# Altium schematic sheet nRF51822.SchDoc: nRF51822
size A4; Revision: Rev.A1; SheetNumber: 1; SheetTotal: 4; DrawnBy: RUBR; DocumentSize: A4; ProjectName: Wikiot
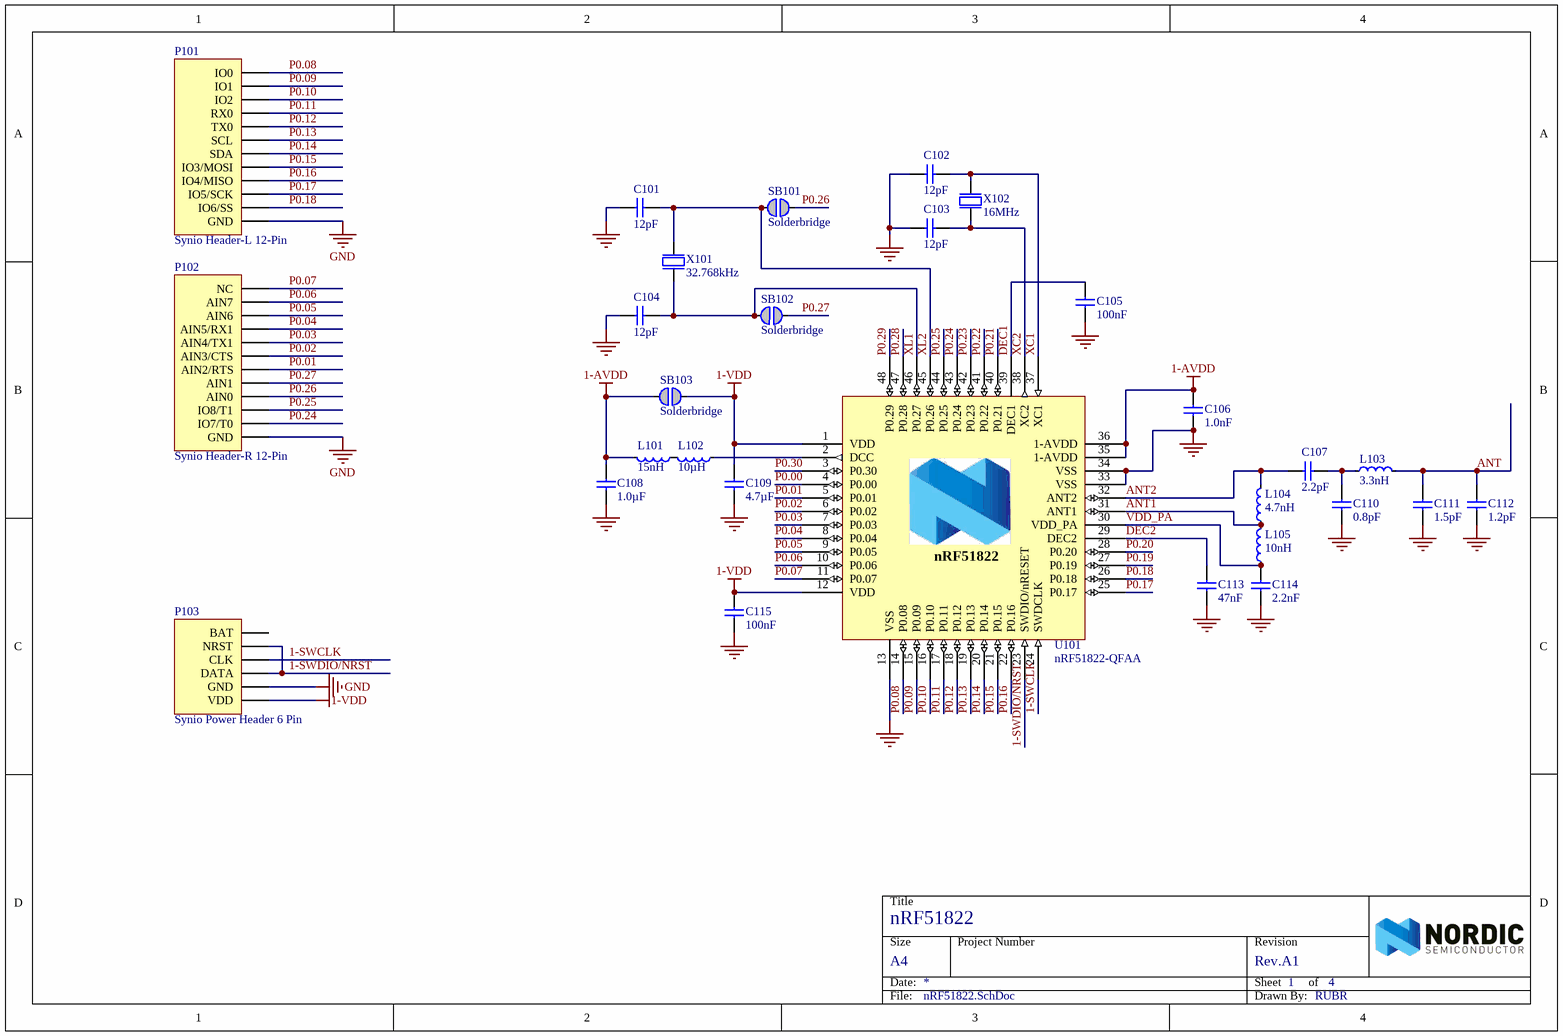
[diagram p0: nRF51822.SchDoc]

## Parts
C101  12pF  [CAPC1005X04L]
C102  12pF  [CAPC1005X04L]
C103  12pF  [CAPC1005X04L]
C104  12pF  [CAPC1005X04L]
C105  100nF  [CAPC1005X04L]
C106  1.0nF  [CAPC1005X04L]
C107  2.2pF  [CAPC1005X04L]
C108  1.0µF  [CAPC1608X06L]
C109  4.7µF  [CAPC1608X06L]
C110  0.8pF  [CAPC1005X04L]
C111  1.5pF  [CAPC1005X04L]
C112  1.2pF  [CAPC1005X04L]
C113  47nF  [CAPC1005X04L]
C114  2.2nF  [CAPC1005X04L]
C115  100nF  [CAPC1005X04L]
L101  15nH  [INDC1005X04L]
L102  10µH  [INDC1608X06L]
L103  3.3nH  [INDC1005X04L]
L104  4.7nH  [INDC1005X04L]
L105  10nH  [INDC1005X04L]
P101  Synio Header-L 12-Pin  [HDR1X12]
P102  Synio Header-R 12-Pin  [HDR1X12]
P103  Synio Power Header 6 Pin  [HDR1X6/2.54MM]
SB101  Solderbridge  [JP2_SMD]  (no BOM)
SB102  Solderbridge  [JP2_SMD]  (no BOM)
SB103  Solderbridge  [JP2_SMD]  (no BOM)
U101  nRF51822-QFAA  [QFN40P600X600X90-48N]
X101  32.768kHz  [FC-135]
X102  16MHz  [BT-XTAL_2520]

## Nets
1-AVDD: C106.1 C108.2 L101.2 SB103.2 U101.35(1-AVDD) U101.36(1-AVDD)
1-VDD: C109.1 C115.1 P103.1(VDD) SB103.1 U101.1(VDD) U101.12(VDD)
GND: C101.2 C102.2 C103.2 C104.2 C105.2 C106.2 C108.1 C109.2 C110.2 C111.2 C112.2 C113.2 C114.2 C115.2 P101.1(GND) P102.1(GND) P103.2(GND) U101.13(VSS) U101.33(VSS) U101.34(VSS) U101.49 X102.2(GND) X102.4(GND)
1-SWCLK: P103.4(CLK) U101.24(SWDCLK)
1-SWDIO/NRST: P103.3(DATA) P103.5(NRST) U101.23(SWDIO/nRESET)
ANT: C111.1 C112.1 L103.2
ANT1: L104.1 L105.2 U101.31(ANT1)
ANT2: C107.1 L104.2 U101.32(ANT2)
DEC1: C105.1 U101.39(DEC1)
DEC2: C113.1 U101.29(DEC2)
P0.00: U101.4(P0.00)
P0.01: P102.6(AIN2/RTS) U101.5(P0.01)
P0.02: P102.7(AIN3/CTS) U101.6(P0.02)
P0.03: P102.8(AIN4/TX1) U101.7(P0.03)
P0.04: P102.9(AIN5/RX1) U101.8(P0.04)
P0.05: P102.10(AIN6) U101.9(P0.05)
P0.06: P102.11(AIN7) U101.10(P0.06)
P0.07: P102.12(NC) U101.11(P0.07)
P0.08: P101.12(IO0) U101.14(P0.08)
P0.09: P101.11(IO1) U101.15(P0.09)
P0.10: P101.10(IO2) U101.16(P0.10)
P0.11: P101.9(RX0) U101.17(P0.11)
P0.12: P101.8(TX0) U101.18(P0.12)
P0.13: P101.7(SCL) U101.19(P0.13)
P0.14: P101.6(SDA) U101.20(P0.14)
P0.15: P101.5(IO3/MOSI) U101.21(P0.15)
P0.16: P101.4(IO4/MISO) U101.22(P0.16)
P0.17: P101.3(IO5/SCK) U101.25(P0.17)
P0.18: P101.2(IO6/SS) U101.26(P0.18)
P0.19: U101.27(P0.19)
P0.20: U101.28(P0.20)
P0.21: U101.40(P0.21)
P0.22: U101.41(P0.22)
P0.23: U101.42(P0.23)
P0.24: P102.2(IO7/T0) U101.43(P0.24)
P0.25: P102.3(IO8/T1) U101.44(P0.25)
P0.26: P102.4(AIN0) SB101.1
P0.27: P102.5(AIN1) SB102.1
P0.28: U101.47(P0.28)
P0.29: U101.48(P0.29)
P0.30: U101.3(P0.30)
VDD_PA: C114.1 L105.1 U101.30(VDD_PA)
XC1: C102.1 U101.37(XC1) X102.1(inp)
XC2: C103.1 U101.38(XC2) X102.3(out)
XL1: C104.1 SB102.2 U101.46(P0.27) X101.1(inp)
XL2: C101.1 SB101.2 U101.45(P0.26) X101.2(out)
NetC107_2: C107.2 C110.1 L103.1
NetL101_1: L101.1 L102.2
NetL102_1: L102.1 U101.2(DCC)

Not connected (* = marked no-connect by the designer): P103 6(BAT)

## Notes on the sheet
- Title
- Size
- Date:
- Project Number
- Sheet         of
- Revision
- File:
- Drawn By:
- (in symbol nRF51822-QFAA-XLR2.4) nRF51822

## Library data of the parts
C101-C104 = C0402-12p: Capacitor, NP0, ±2%; Note: 50V; Artikkelnr Noca: 20029159; Part Number: C0402-12p; Manufacturer: *; Manufacturer Part Number: *; Datasheet: *; Footprint: 0402; LatestRevisionDate: 2011-05-11; Pin Count: 2; Publisher: Nordic Semiconductor; Published: 2009-05-08; Value: 12pF; Supplier: *; Supplier part number: *; 2nd source Supplier: *; 2nd source part number: *
C105 C115 = C0402-100n: Capacitor, X7R, ±10%; Note: 16V; Artikkelnr Noca: 20039200; Part Number: C0402-100n; Manufacturer: *; Manufacturer Part Number: *; Datasheet: *; Footprint: 0402; LatestRevisionDate: 2009-11-23; Pin Count: 2; Publisher: Nordic Semiconductor; Published: 2009-05-08; Value: 100nF; Supplier: *; Supplier part number: *; 2nd source Supplier: *; 2nd source part number: *
C106 = C0402-1n0: Capacitor, X7R, ±10%; Note: 50V; Artikkelnr Noca: 20039223; Part Number: C0402-1n0; Manufacturer: *; Manufacturer Part Number: *; Datasheet: *; Footprint: 0402; LatestRevisionDate: 2009-11-23; Pin Count: 2; Publisher: Nordic Semiconductor; Published: 2009-05-08; Value: 1.0nF; Supplier: *; Supplier part number: *; 2nd source Supplier: *; 2nd source part number: *
C107 = C0402-2.2p: Capacitor, NP0, ±0.1pF; Note: 50V; Artikkelnr Noca: 20029145; Part Number: C0402-2.2p; Manufacturer: *; Manufacturer Part Number: *; Datasheet: *; Footprint: 0402; LatestRevisionDate: 2009-05-08; Pin Count: 2; Publisher: Nordic Semiconductor; Published: 2009-05-08; Value: 2.2pF; Supplier: *; Supplier part number: *; 2nd source Supplier: *; 2nd source part number: *
C108 = C0603-1µ0: Capacitor, X7R, ±10%; Note: 16V; Artikkelnr Noca: 20039335; Part Number: C0603-1µ0; Manufacturer: *; Manufacturer Part Number: *; Datasheet: *; Footprint: 0603; LatestRevisionDate: 2013-06-05; Pin Count: 2; Publisher: Nordic Semiconductor; Published: 2009-05-08; Value: 1.0µF; Supplier: *; Supplier part number: *; 2nd source Supplier: *; 2nd source part number: *
C109 = C0603-4µ7: Capacitor, X5R, ±10%; Note: 6.3V; Artikkelnr Noca: 20069060; Part Number: C0603-4µ7; Manufacturer: *; Manufacturer Part Number: *; Datasheet: *; Footprint: 0603; LatestRevisionDate: 2009-11-23; Pin Count: 2; Publisher: Nordic Semiconductor; Published: 2009-05-08; Value: 4.7µF; Supplier: *; Supplier part number: *; 2nd source Supplier: *; 2nd source part number: *
C110 = C0402-0.8p: Capacitor, NP0, ±5%; Note: 50V; Artikkelnr Noca: 20029147; Part Number: C0402-0.8p; Manufacturer: *; Manufacturer Part Number: *; Datasheet: *; Footprint: 0402; LatestRevisionDate: 2012-11-21; Pin Count: 2; Publisher: Nordic Semiconductor; Published: 2009-05-08; Value: 0.8pF; Supplier: *; Supplier part number: *; 2nd source Supplier: *; 2nd source part number: *
C111 = C0402-1.5p: Capacitor, NP0, ±0.1pF; Note: 50V; Artikkelnr Noca: 20029139; Part Number: C0402-1.5p; Manufacturer: *; Manufacturer Part Number: *; Datasheet: *; Footprint: 0402; LatestRevisionDate: 2009-11-23; Pin Count: 2; Publisher: Nordic Semiconductor; Published: 2009-05-08; Value: 1.5pF; Supplier: *; Supplier part number: *; 2nd source Supplier: *; 2nd source part number: *
C112 = C0402-1.2p: Capacitor, NP0, ±0.1pF; Note: 50V; Artikkelnr Noca: 20029157; Part Number: C0402-1.2p; Manufacturer: *; Manufacturer Part Number: *; Datasheet: *; Footprint: 0402; LatestRevisionDate: 2011-05-11; Pin Count: 2; Publisher: Nordic Semiconductor; Published: 2009-05-08; Value: 1.2pF; Supplier: *; Supplier part number: *; 2nd source Supplier: *; 2nd source part number: *
C113 = C0402-47n: Capacitor, X7R, ±10%; Note: Chip Cap 10%; Artikkelnr Noca: 20039389; Part Number: C0402-47n; Manufacturer: *; Manufacturer Part Number: *; Datasheet: *; Footprint: 0402; LatestRevisionDate: 2009-05-08; Pin Count: 2; Publisher: Nordic Semiconductor; Published: 2009-05-08; Value: 47nF; Supplier: *; Supplier part number: *; 2nd source Supplier: *; 2nd source part number: *
C114 = C0402-2n2: Capacitor, X7R, ±10%; Note: 50V; Artikkelnr Noca: 20039221; Part Number: C0402-2n2; Manufacturer: *; Manufacturer Part Number: *; Datasheet: *; Footprint: 0402; LatestRevisionDate: 2009-11-23; Pin Count: 2; Publisher: Nordic Semiconductor; Published: 2009-05-08; Value: 2.2nF; Supplier: *; Supplier part number: *; 2nd source Supplier: *; 2nd source part number: *
L101 = L0402-15n: Inductor, 320mA, ±5%; Manufacturer: Taiyo Yuden; Manufacturer Part Number: HK100515NJ-T; 2nd source part number: 658-1328; Note: High frequency chip inductor ±10%; Artikkelnr Noca: 33029323; Part Number: L0402-15n; Footprint: 0402; LatestRevisionDate: 2012-09-19; Pin Count: 2; Publisher: Nordic Semiconductor; Published: 2010-07-12; Value: 15nH; Supplier: Digi-Key; Datasheet: http://www.yuden.co.jp/productdata/catalog/en/mlci04_e.pdf; Supplier part number: 587-1521-1-ND; 2nd source Supplier: Farnell
L102 = L0603-10µ: Inductor, 80mA, ±10%; Manufacturer: Taiyo Yuden; Manufacturer Part Number: LBMF1608T100K; 2nd source part number: 178-6105; Note: LBMF1608T100K 10µH 80mA 0603; Artikkelnr Noca: 33029314; Part Number: L0603-10µ; Datasheet: http://www.yuden.co.jp/ut/product/pdf/elb2_e.pdf; Footprint: 0603; LatestRevisionDate: 2012-09-19; Pin Count: 2; Publisher: Nordic Semiconductor; Published: 2010-02-24; Value: 10µH; Supplier: Digi-Key; Supplier part number: 587-1714-1-ND; 2nd source Supplier: Farnell
L103 = L0402-3n3: Inductor, 190mA, ±0.1nH; Manufacturer: Murata; Manufacturer Part Number: LQP15MN3N3B02D; Note: High frequency chip inductor ±5%; Artikkelnr Noca: 33029369; Part Number: L0402-3n3; Datasheet: http://search.murata.co.jp/Ceramy/image/img/PDF/ENG/L0075S0084LQP15M.pdf; Footprint: 0402; LatestRevisionDate: 2012-09-19; Pin Count: 2; Publisher: Nordic Semiconductor; Published: 2009-05-08; Value: 3.3nH; Supplier: Digi-Key; Supplier part number: 490-1130-1-ND; 2nd source Supplier: *; 2nd source part number: *
L104 = L0402-4n7: Inductor, 160mA, ±0.1nH; Manufacturer: Murata; Manufacturer Part Number: LQP15MN4N7B02D; Note: High frequency chip inductor ±5%; Artikkelnr Noca: 33029164; Part Number: L0402-4n7; Datasheet: http://search.murata.co.jp/Ceramy/image/img/PDF/ENG/L0075S0084LQP15M.pdf; Footprint: 0402; LatestRevisionDate: 2012-09-19; Pin Count: 2; Publisher: Nordic Semiconductor; Published: 2009-05-08; Value: 4.7nH; Supplier: Digi-Key; Supplier part number: 490-1132-1-ND; 2nd source Supplier: *; 2nd source part number: *
L105 = L0402-10n: Inductor, 100mA, ±2%; Manufacturer: Murata; Manufacturer Part Number: LQP15MN10NG02D; Note: High frequency chip inductor ±5%; Artikkelnr Noca: 33029425; Part Number: L0402-10n; Datasheet: http://search.murata.co.jp/Ceramy/image/img/PDF/ENG/L0075S0084LQP15M.pdf; Footprint: 0402; LatestRevisionDate: 2012-09-19; Pin Count: 2; Publisher: Nordic Semiconductor; Published: 2010-07-12; Value: 10nH; Supplier: Mouser; Supplier part number: 81-LQP15MN10NG02D; 2nd source Supplier: *; 2nd source part number: *
P101 = Synio Header-L 12-Pin: Synio Header-L, 12-Pin; LatestRevisionDate: 17-Jul-2002; LatestRevisionNote: Re-released for DXP Platform.; Publisher: Altium Limited
P102 = Synio Header-R 12-Pin: Synio Header-R, 12-Pin; LatestRevisionDate: 17-Jul-2002; LatestRevisionNote: Re-released for DXP Platform.; Publisher: Altium Limited
SB101-SB103 = Solderbridge: Artikkelnr Noca: N.A.; Part Number: Solderbridge; Manufacturer: *; Manufacturer Part Number: *; Datasheet: *; Footprint: Solderbridge; LatestRevisionDate: 2009-12-14; Pin Count: 2; Publisher: Nordic Semiconductor; Published: 2009-12-14; Value: Solderbridge; Note: *; Supplier: *; Supplier part number: *; 2nd source Supplier: *; 2nd source part number: *
U101 = nRF51822-QFAA-XLR2.4: Multi-protocol Bluetooth Low Energy and 2.4GHz proprietary system-on-chip; Manufacturer: Nordic Semiconductor; Manufacturer Part Number: nRF51822-QFAAGx; Note: nRF51822 - QFN48 6x6 0.4mm pitch; Artikkelnr Noca: 15079242; Part Number: nRF51822-QFAA-XLR2.4; Datasheet: *; Footprint: QFN-48; LatestRevisionDate: 2013-10-18; Pin Count: 48; Publisher: Nordic Semiconductor; Published: 2013-09-04; Value: nRF51822-QFAA; Supplier: Nordic Semiconductor; Supplier part number: *; 2nd source Supplier: *; 2nd source part number: *
X101 = XTAL_FC-135 32.768k: EPSON TOYOCOM - FC-135 32.768KHZ ±20PPM,9.0PF - CRYSTAL, SM, WATCH; 2nd source part number: 127-8037; Note: XTAL SMD 32.768kHz, 3215; Artikkelnr Noca: 22019091; Part Number: XTAL_FC-135 32.768k; Manufacturer: Epson Toyocom; Manufacturer Part Number: FC-135 32.768KHZ ±20PPM,9.0PF; Datasheet: http://www.farnell.com/datasheets/57480.pdf; LatestRevisionDate: 2010-10-18; Pin Count: 2; Publisher: Nordic Semiconductor; Published: 2010-10-18; Value: 32.768kHz; Supplier: Digi-Key; Supplier part number: FC-135 32.7680KA-AC-ND; 2nd source Supplier: Farnell
X102 = NX2520SA-16MHZ-STD-CSW-5: XTAL SMD 2520, 16MHz, 8pF, ±15ppm; Manufacturer: NDK; Note: XTAL SMD 16.000MHz; Artikkelnr Noca: 22019192; Part Number: NX2520SA-16MHZ-STD-CSW-5; Manufacturer Part Number: NX2520SA-16MHZ-STD-CSW-5; Datasheet: http://www.ndk.com/images/products/catalog/c_NX2520SA-STD-CSW-5_e.pdf; LatestRevisionDate: 2012-06-15; Pin Count: 4; Publisher: Nordic Semiconductor; Published: 2012-06-15; Value: 16MHz; Supplier: Digi-Key; Supplier part number: 644-1169-1-ND; 2nd source Supplier: *; 2nd source part number: *